# EAGLE design rPiMIDIShield (EAGLE 6.5.0)
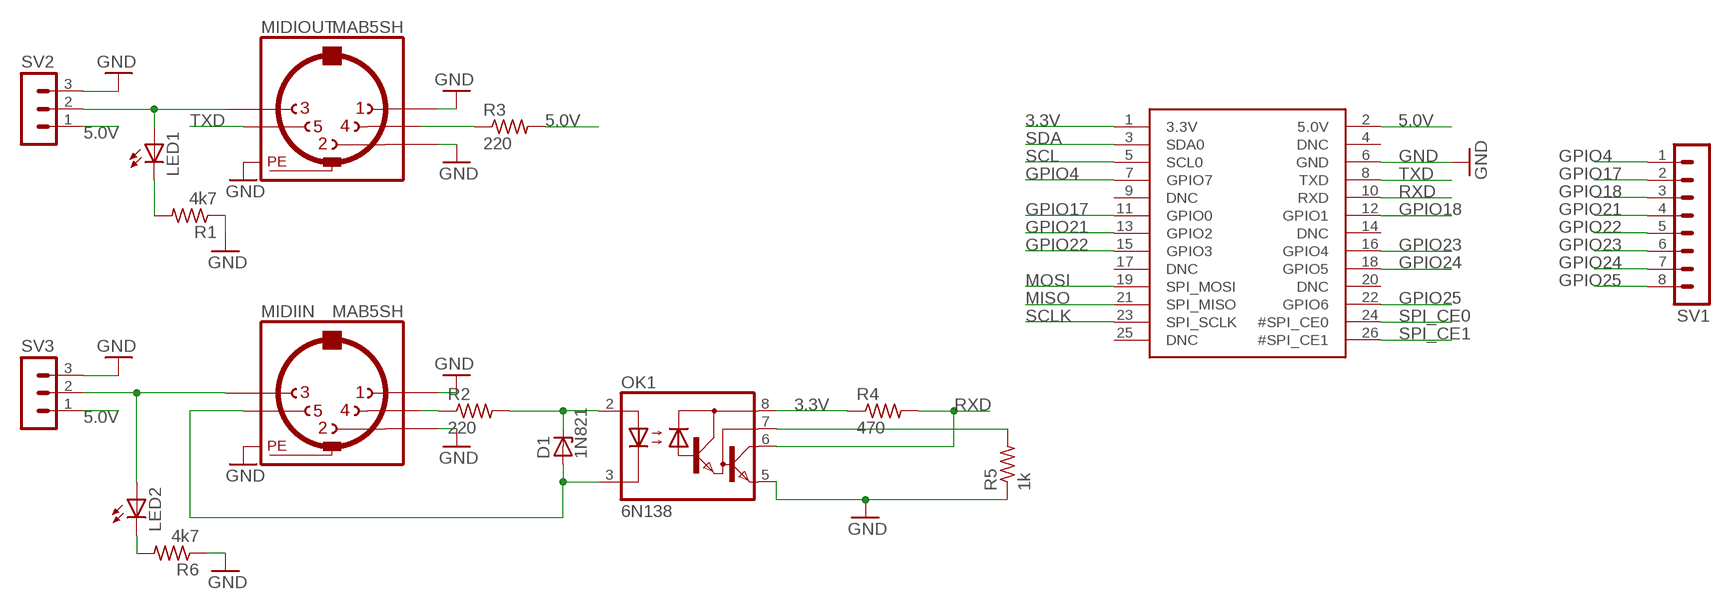
[diagram p0: schematic, sheet 1]

## Parts
D1  1N821  [DO35Z10]
GPIO  RASPBERRYPI_BB  [RASBERRYPI_SHIELD]
LED1  LEDLSU260  [LSU260]
LED2  LEDLSU260  [LSU260]
MIDIIN  MAB5SH  [MAB5SH]
MIDIOUT  MAB5SH  [MAB5SH]
OK1  6N138  [DIL08]
R1  4k7  R-US_0204/7  [0204/7]
R2  220  R-US_0204/7  [0204/7]
R3  220  R-US_0204/7  [0204/7]
R4  470  R-US_0204/7  [0204/7]
R5  1k  R-US_0204/7  [0204/7]
R6  4k7  R-US_0204/7  [0204/7]
SV1  MA08-1  [MA08-1]
SV2  MA03-1  [MA03-1]
SV3  MA03-1  [MA03-1]

## Nets
3.3V: GPIO.1(3.3V) OK1.8(VCC) R4.1
5.0V: GPIO.2(5.0V) R3.2 SV2.1 SV3.1
GND: GPIO.6(GND) MIDIIN.1 MIDIIN.2 MIDIIN.PE MIDIIN.PE@(PE) MIDIOUT.1 MIDIOUT.2 MIDIOUT.PE MIDIOUT.PE@(PE) OK1.5(GND) R1.1 R5.1 R6.1 SV2.3 SV3.3
GPIO4: GPIO.7(GPIO7) SV1.1
GPIO17: GPIO.11(GPIO0) SV1.2
GPIO18: GPIO.12(GPIO1) SV1.3
GPIO21: GPIO.13(GPIO2) SV1.4
GPIO22: GPIO.15(GPIO3) SV1.5
GPIO23: GPIO.16(GPIO4) SV1.6
GPIO24: GPIO.18(GPIO5) SV1.7
GPIO25: GPIO.22(GPIO6) SV1.8
MISO: GPIO.21(SPI_MISO)
MOSI: GPIO.19(SPI_MOSI)
N$1: LED2.A MIDIIN.3 SV3.2
N$2: LED1.A MIDIOUT.3 SV2.2
N$3: MIDIOUT.4 R3.1
N$4: MIDIIN.4 R2.1
N$5: LED1.K(C) R1.2
N$6: OK1.7(VB) R5.2
N$10: D1.A MIDIIN.5 OK1.3(C)
N$11: D1.C OK1.2(A) R2.2
N$13: LED2.K(C) R6.2
RXD: GPIO.10(RXD) OK1.6(VO) R4.2
SCL: GPIO.5(SCL0)
SCLK: GPIO.23(SPI_SCLK)
SDA: GPIO.3(SDA0)
SPI_CE0: GPIO.24(#SPI_CE0)
SPI_CE1: GPIO.26(#SPI_CE1)
TXD: GPIO.8(TXD) MIDIOUT.5
Unconnected: GPIO.4(DNC) GPIO.9(DNC) GPIO.14(DNC) GPIO.17(DNC) GPIO.20(DNC) GPIO.25(DNC)

## Library data of the parts
D1 = diode:1N821: Reference DIODE temperature compensated, 6,2 V
GPIO = microbuilder:RASPBERRYPI_B
LED1 LED2 = led:LED: LED OSRAM: - CHIPLED LG R971, LG N971, LY N971, LG Q971, LY Q971, LO R971, LY R971 LH N974, LH R974 LS Q976, LO Q976, LY Q976 LO Q996 - Hyper CHIPLED LW Q18S LB Q993, LB Q99A, LB R99A - SideLED LS A670, LO A670, LY A670, LG A670, LP A670 LB A673, LV A673, LT A673, LW A673 LH A674 LY A675 LS A676, LA A676, LO A676, LY A676, LW A676 LS A679, LY A679, LG A679 - Hyper Micro SIDELED® LS Y876, LA Y876, LO Y876, LY Y876 LT Y87S - SmartLED LW L88C, LW L88S LB L89C, LB L89S, LG L890 LS L89K, LO L89K, LY L89K LS L896, LA L896, LO L896, LY L896 - TOPLED LS T670, LO T670, LY T670, LG T670, LP T670 LSG T670, LSP T670, LSY T670, LOP T670, LYG T670 LG T671, LOG T671, LSG T671 LB T673, LV T673, LT T673, LW T673 LH T674 LS T676, LA T676, LO T676, LY T676, LB T676, LH T676, LSB T676, LW T676 LB T67C, LV T67C, LT T67C, LS T67K, LO T67K, LY T67K, LW E67C LS E67B, LA E67B, LO E67B, LY E67B, LB E67C, LV E67C, LT E67C LW T67C LS T679, LY T679, LG T679 LS T770, LO T770, LY T770, LG T770, LP T770 LB T773, LV T773, LT T773, LW T773 LH T774 LS E675, LA E675, LY E675, LS T675 LS T776, LA T776, LO T776, LY T776, LB T776 LHGB T686 LT T68C, LB T68C - Hyper Mini TOPLED® LB M676 - Mini TOPLED Santana® LG M470 LS M47K, LO M47K, LY M47K Source: http://www.osram.convergy.de LUXEON: - LUMILED® LXK2-PW12-R00, LXK2-PW12-S00, LXK2-PW14-U00, LXK2-PW14-V00 LXK2-PM12-R00, LXK2-PM12-S00, LXK2-PM14-U00 LXK2-PE12-Q00, LXK2-PE12-R00, LXK2-PE12-S00, LXK2-PE14-T00, LXK2-PE14-U00 LXK2-PB12-K00, LXK2-PB12-L00, LXK2-PB12-M00, LXK2-PB14-N00, LXK2-PB14-P00, LXK2-PB14-Q00 LXK2-PR12-L00, LXK2-PR12-M00, LXK2-PR14-Q00, LXK2-PR14-R00 LXK2-PD12-Q00, LXK2-PD12-R00, LXK2-PD12-S00 LXK2-PH12-R00, LXK2-PH12-S00 LXK2-PL12-P00, LXK2-PL12-Q00, LXK2-PL12-R00 Source: www.luxeon.com KINGBRIGHT: KA-3528ASYC Source: www.kingbright.com
MIDIIN MIDIOUT = con-hirschmann:MAB5SH: Female CONNECTOR 5 pins 90 deg. with shield, horizontal (DIN 41524); OC_FARNELL: 809883; OC_NEWARK: unknown
OK1 = optocoupler:6N138: MOTOROLA OPTO COUPLER; MF: VISHAY/TELEFUNKEN; MPN: 6N138; OC_FARNELL: 9860150; OC_NEWARK: 35K5294
R1-R6 = resistor:R-US_: RESISTOR, American symbol
SV1 = con-lstb:MA08-1: PIN HEADER; OC_FARNELL: unknown; OC_NEWARK: unknown
SV2 SV3 = con-lstb:MA03-1: PIN HEADER; OC_FARNELL: unknown; OC_NEWARK: unknown

## Board
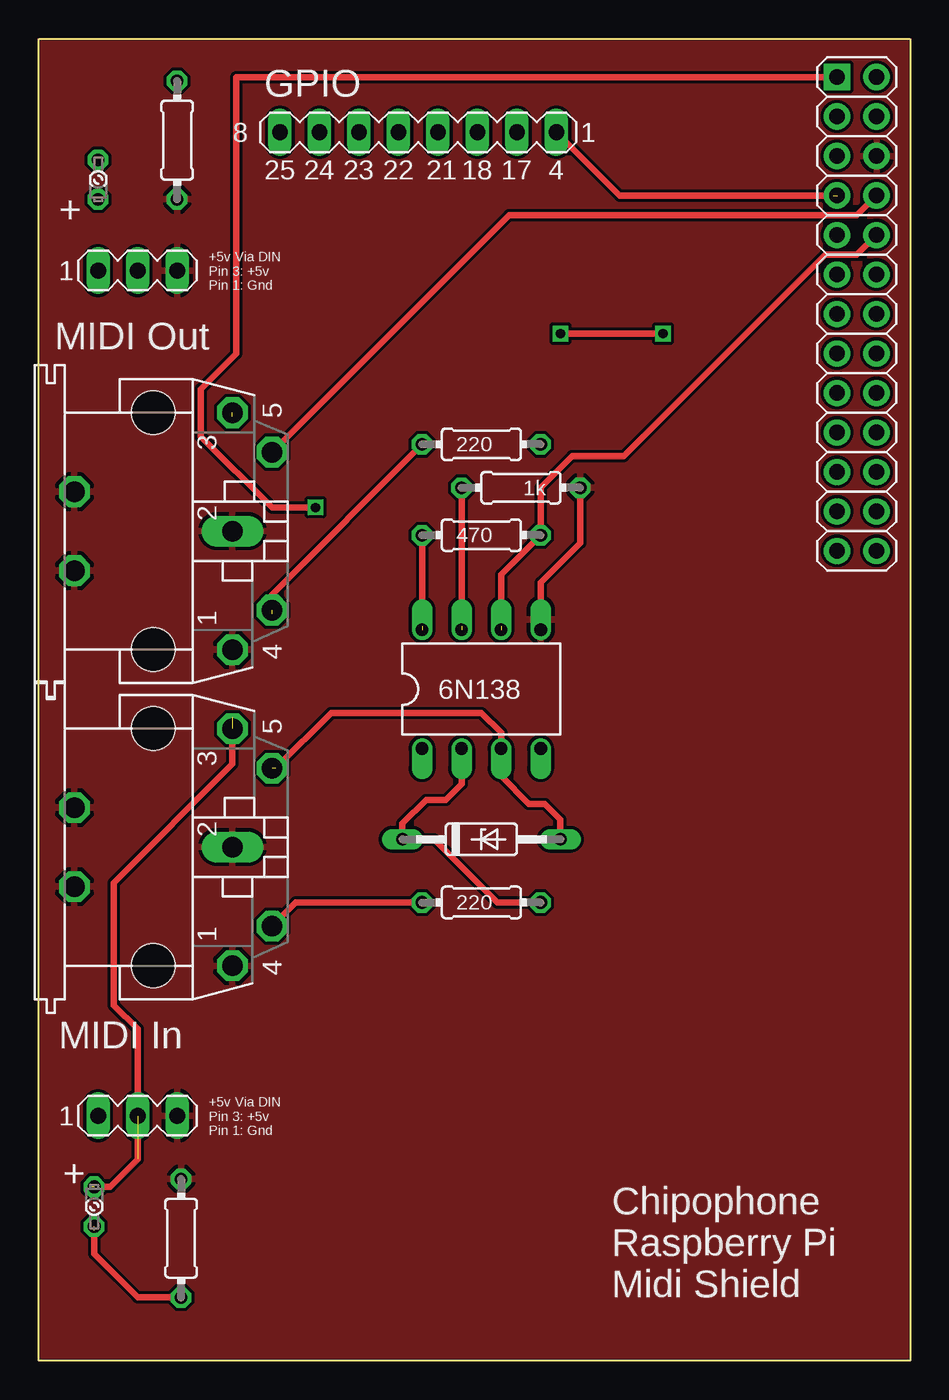
[diagram p1: board, top side]
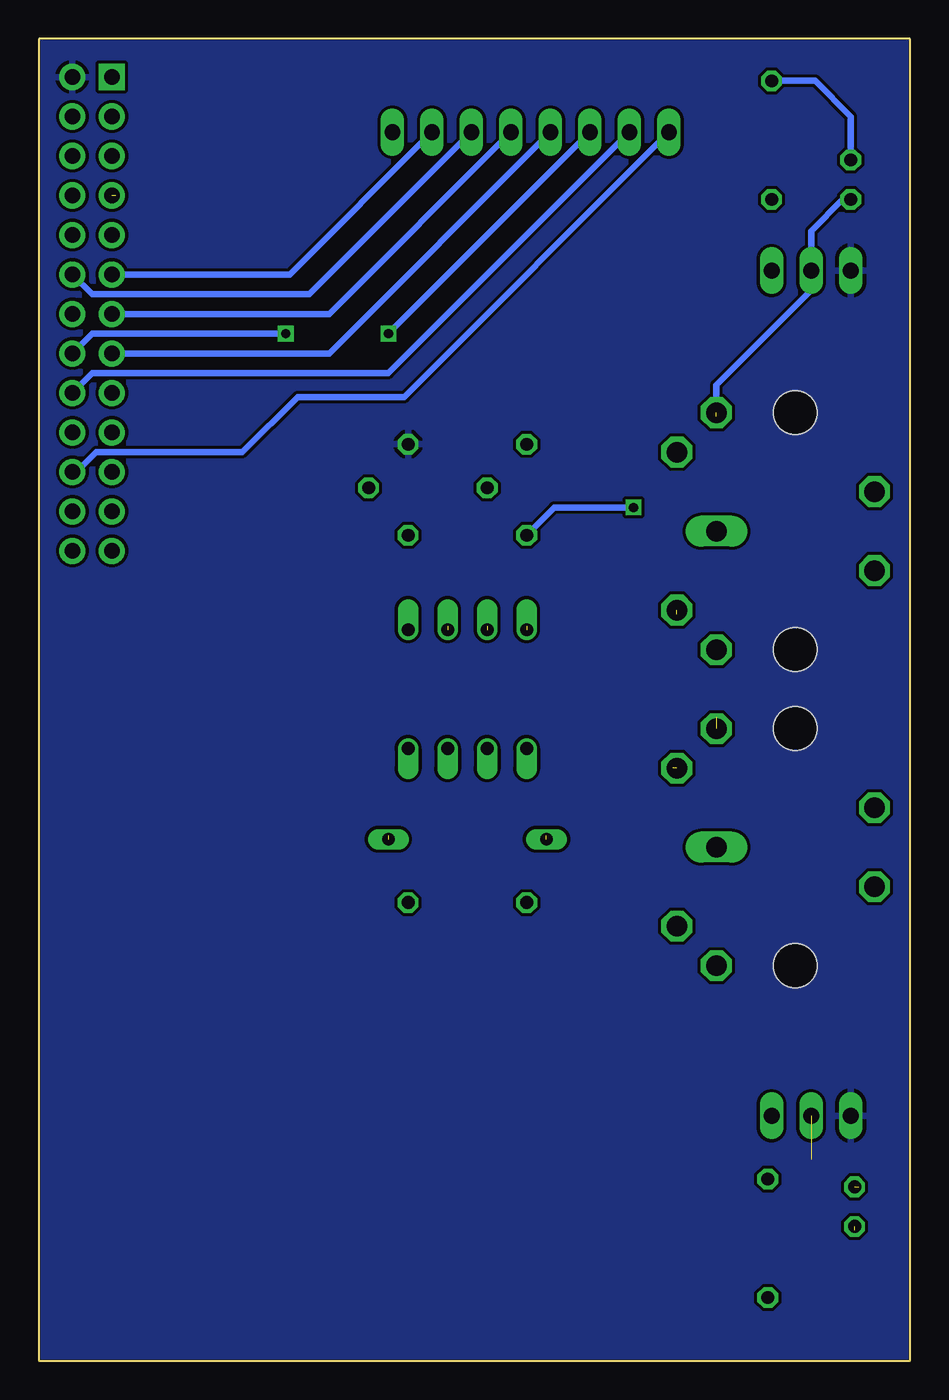
[diagram p2: board, bottom side, seen from below]

Size 56 x 85 mm. Coordinates in mm from the lower left corner, seen from the top.
Copper layers (1*16): Top 0.035mm / dielectric 1.5mm / Bottom 0.035mm
Design rules "default": minimum track width 8mil, minimum drill 15mil, track to track 8mil, track to pad 8mil, pad to pad 8mil, via to via 8mil, smd to smd 8mil, copper to edge 1mil, drill to drill 8mil, minimum pad ring 10mil, minimum via ring 8mil, stop-mask expansion 4mil, vias tented up to drill 20mil, thermal gap 10mil

### Footprints (pad centres in the part's own frame; a part is rotated, then mirrored left to right if it is on the bottom)
DO35Z10 = drill 0.813 long: A 5.08,0; C -5.08,0
RASBERRYPI_SHIELD = drill 1 pad 1.676 square: 1 51.308,82.55 | drill 1 pad 1.676: 2 53.848,82.55; 3 51.308,80.01; 4 53.848,80.01; 5 51.308,77.47; 6 53.848,77.47; 7 51.308,74.93; 8 53.848,74.93; 9 51.308,72.39; 10 53.848,72.39; 11 51.308,69.85; 12 53.848,69.85; 13 51.308,67.31; 14 53.848,67.31; 15 51.308,64.77; 16 53.848,64.77; 17 51.308,62.23; 18 53.848,62.23; 19 51.308,59.69; 20 53.848,59.69; 21 51.308,57.15; 22 53.848,57.15; 23 51.308,54.61; 24 53.848,54.61; 25 51.308,52.07; 26 53.848,52.07
LSU260 = drill 0.813 octagon: A -1.27,0; K 1.27,0
MAB5SH = drill 1.321 octagon: 1 7.62,5.08; 3 -7.62,5.08; 4 5.08,7.62; 5 -5.08,7.62; PE -2.54,-5.08; PE@ 2.54,-5.08 | drill 1.321 long: 2 0,5.08 | hole 2.794: 7.62,0; -7.62,0
DIL08 = drill 0.813 offset: 1 -3.81,-3.81; 2 -1.27,-3.81; 3 1.27,-3.81; 4 3.81,-3.81; 5 3.81,3.81; 6 1.27,3.81; 7 -1.27,3.81; 8 -3.81,3.81
0204/7 = drill 0.813 octagon: 1 -3.81,0; 2 3.81,0
MA08-1 = drill 1.016 long: 1 -8.89,0; 2 -6.35,0; 3 -3.81,0; 4 -1.27,0; 5 1.27,0; 6 3.81,0; 7 6.35,0; 8 8.89,0
MA03-1 = drill 1.016 long: 1 -2.54,0; 2 0,0; 3 2.54,0

### Placement (x,y rotation side)
D1  28.45,33.53 0 top
GPIO  0,0 0 top
LED1  3.81,75.95 90 top
LED2  3.56,9.91 270 top
MIDIIN  7.37,33.02 270 top
MIDIOUT  7.37,53.34 270 top
OK1  28.45,43.18 0 top
R1  8.89,78.49 90 top
R2  28.45,29.46 0 top
R3  28.45,58.93 0 top
R4  28.45,53.09 0 top
R5  30.99,56.13 180 top
R6  9.14,7.87 270 top
SV1  24.38,78.99 180 top
SV2  6.35,70.1 0 top
SV3  6.35,15.75 0 top

### Tracks (layer width: path | path; a pad name or v marks a point on that pad's centre or on a via)
3.3V  (via drill 0.6)  (1 unrouted)
  Top 0.406: R4.1 24.64,47.24 | GPIO.1 12.7,82.55 12.7,64.77 10.41,62.48 10.41,59.44 14.99,54.86 v17.78,54.86
  Bottom 0.406: v17.78,54.86 22.86,54.86 R4.1
5.0V
  pour Bottom: 0,85.09 0,0 56.13,0 56.13,85.09
GND
  pour Top: 0,85.09 0,0 56.13,0 56.13,85.09
GPIO4  (1 unrouted)
  Top 0.406: 51.05,74.93 37.34,74.93 SV1.1
GPIO17
  Bottom 0.406: GPIO.11 39.88,69.85 SV1.2
GPIO18
  Bottom 0.406: GPIO.12 52.58,68.58 38.61,68.58 SV1.3
GPIO21
  Bottom 0.406: GPIO.13 37.34,67.31 SV1.4
GPIO22
  Bottom 0.406: GPIO.15 37.34,64.77 SV1.5
GPIO23  (via drill 0.6)
  Top 0.406: v40.13,66.04 v33.53,66.04
  Bottom 0.406: GPIO.16 52.58,66.04 v40.13,66.04 | v33.53,66.04 SV1.6
GPIO24
  Bottom 0.406: GPIO.18 52.58,63.5 33.53,63.5 SV1.7
GPIO25
  Bottom 0.406: GPIO.22 53.59,57.15 52.32,58.42 42.93,58.42 39.37,61.98 32.51,61.98 SV1.8
N$1  (3 unrouted)
  Top 0.406: 3.3,11.18 4.57,11.18 6.35,12.95 6.35,21.34 4.83,22.86 4.83,30.73 12.45,38.35 12.45,41.4
N$2  (1 unrouted)
  Bottom 0.406: LED1.A 4.32,74.68 6.35,72.64 SV2.2 6.35,68.83 12.45,62.74 12.45,60.71
N$3  (1 unrouted)
  Top 0.406: R3.1 14.99,49.28 14.99,48.01
N$4
  Top 0.406: R2.1 16.51,29.46 MIDIIN.4
N$5
  Bottom 0.406: LED1.K 3.81,80.01 6.1,82.3 R1.2
N$6  (1 unrouted)
  Top 0.406: R5.2 27.18,47.24
N$9
  Top 0.406: 32.26,47.24 32.26,50.04 34.8,52.58 34.8,55.88 35.05,56.13
N$10  (2 unrouted)
  Top 0.406: 33.53,33.78 33.53,34.8 32.51,35.81 31.5,35.81 29.72,37.59 OK1.3 29.72,40.39 28.45,41.66 18.8,41.66 15.24,38.1
N$11  (1 unrouted)
  Top 0.406: 23.37,33.78 23.37,34.54 24.89,36.07 26.16,36.07 27.18,37.08 OK1.2 | D1.C 25.4,33.53 29.46,29.46 R2.2
N$13  (1 unrouted)
  Top 0.406: 3.56,8.38 3.56,6.86 6.35,4.06 R6.2
RXD  (1 unrouted)
  Top 0.406: 29.72,47.24 29.72,50.55 R4.2 32.26,56.13 34.29,58.17 37.59,58.17 50.55,71.12 52.58,71.12 GPIO.10 53.85,72.64
TXD
  Top 0.406: GPIO.8 52.58,73.66 30.23,73.66 MIDIOUT.5

### Text on the board
tNames: GPIO | 25 | 24 | 23 | 22 | 21 | 18 | 17 | 4 | + | +5v Via DIN / Pin 3: +5v / Pin 1: Gnd | MIDI Out | MIDI In | +5v Via DIN / Pin 3: +5v / Pin 1: Gnd | + | Chipophone / Raspberry Pi / Midi Shield